# Altium schematic sheet AP2302B.schdoc
size 49 x 30 mm
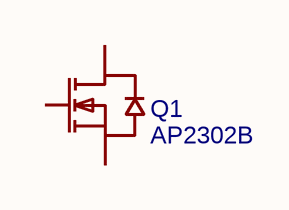
[diagram p0: AP2302B.schdoc]

## Parts
Q1  AP2302B  [SOT-23_L2.9-W1.3-P1.90-LS2.4-BR]

## Nets

Not connected (* = marked no-connect by the designer): Q1 1(G) 2(S) 3(D)

## Library data of the parts
Q1 = AP2302B: BOM_Manufacturer: ShenZhen Quan Li Semiconductor; Contributor: LCSC; BOM_Supplier: LCSC; BOM_Supplier Part: C406812; BOM_Manufacturer Part: AP2302B; BOM_JLCPCB Part Class: Extended Part; spicePre: Q; spiceSymbolName: AP2302B